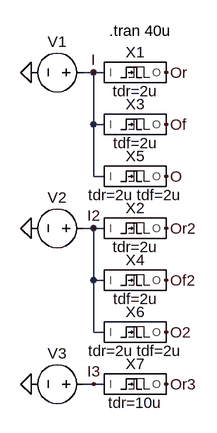
[diagram p0: schematic test-delay.asc]
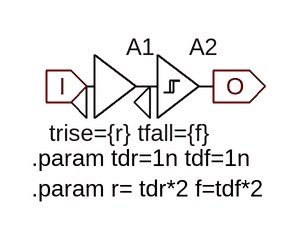
[diagram p1: sub-circuit delay.asc]
test-delay.asc, the LTspice schematic file:
Version 4
SHEET 1 880 680
WIRE 144 128 128 128
WIRE 160 128 144 128
WIRE 144 208 144 128
WIRE 160 208 144 208
WIRE 144 288 144 208
WIRE 160 288 144 288
WIRE 144 368 128 368
WIRE 160 368 144 368
WIRE 144 448 144 368
WIRE 160 448 144 448
WIRE 144 528 144 448
WIRE 160 528 144 528
WIRE 144 608 128 608
WIRE 160 608 144 608
FLAG 48 128 0
FLAG 144 128 I
FLAG 48 368 0
FLAG 144 368 I2
FLAG 256 128 Or
FLAG 256 368 Or2
FLAG 256 208 Of
FLAG 256 448 Of2
FLAG 256 288 O
FLAG 256 528 O2
FLAG 48 608 0
FLAG 144 608 I3
FLAG 256 608 Or3
SYMBOL delay 208 128 R0
WINDOW 39 0 44 Bottom 2
SYMATTR SpiceLine tdr=2u
SYMATTR InstName X1
SYMBOL voltage 144 128 M270
WINDOW 0 32 56 VTop 2
WINDOW 3 -32 56 Invisible 2
WINDOW 123 0 0 Left 0
WINDOW 39 0 0 Left 0
SYMATTR InstName V1
SYMATTR Value PULSE(0 1 10u 1n 1n 10u 20u)
SYMBOL voltage 144 368 M270
WINDOW 0 32 56 VTop 2
WINDOW 3 -32 56 Invisible 2
WINDOW 123 0 0 Left 0
WINDOW 39 0 0 Left 0
SYMATTR InstName V2
SYMATTR Value PULSE(0 1 10u 1n 1n 5u 20u)
SYMBOL delay 208 368 R0
WINDOW 39 0 44 Bottom 2
SYMATTR SpiceLine tdr=2u
SYMATTR InstName X2
SYMBOL delay 208 208 R0
WINDOW 39 0 44 Bottom 2
SYMATTR SpiceLine tdf=2u
SYMATTR InstName X3
SYMBOL delay 208 448 R0
WINDOW 39 0 44 Bottom 2
SYMATTR SpiceLine tdf=2u
SYMATTR InstName X4
SYMBOL delay 208 288 R0
WINDOW 39 0 44 Bottom 2
SYMATTR SpiceLine tdr=2u tdf=2u
SYMATTR InstName X5
SYMBOL delay 208 528 R0
WINDOW 39 0 44 Bottom 2
SYMATTR SpiceLine tdr=2u tdf=2u
SYMATTR InstName X6
SYMBOL voltage 144 608 M270
WINDOW 0 32 56 VTop 2
WINDOW 3 -32 56 Invisible 2
WINDOW 123 0 0 Left 0
WINDOW 39 0 0 Left 0
SYMATTR InstName V3
SYMATTR Value PULSE(0 1 10u 1n 1n 5u 20u)
SYMBOL delay 208 608 R0
WINDOW 39 0 44 Bottom 2
SYMATTR SpiceLine tdr=10u
SYMATTR InstName X7
TEXT 168 64 Left 2 !.tran 40u

delay.asc, the sub-circuit schematic file:
Version 4
SHEET 1 880 680
FLAG 144 176 0
FLAG 208 176 0
FLAG 272 160 O
IOPIN 272 160 Out
FLAG 144 160 I
IOPIN 144 160 In
SYMBOL Digital\\buf1 144 96 R0
WINDOW 3 -38 111 Left 2
SYMATTR Value trise={r} tfall={f}
SYMATTR InstName A1
SYMBOL Digital\\schmtbuf 208 96 R0
SYMATTR InstName A2
TEXT 88 232 Left 2 !.param tdr=1n tdf=1n\n.param r= tdr*2 f=tdf*2

The netlist it stands for:
* test-delay.asc
XX1 I Or delay params: tdr=2u
V1 I 0 PULSE(0 1 10u 1n 1n 10u 20u)
V2 I2 0 PULSE(0 1 10u 1n 1n 5u 20u)
XX2 I2 Or2 delay params: tdr=2u
XX3 I Of delay params: tdf=2u
XX4 I2 Of2 delay params: tdf=2u
XX5 I O delay params: tdr=2u tdf=2u
XX6 I2 O2 delay params: tdr=2u tdf=2u
V3 I3 0 PULSE(0 1 10u 1n 1n 5u 20u)
XX7 I3 Or3 delay params: tdr=10u

* block symbol definitions
.subckt delay I O
A1 I 0 0 0 0 0 P001 0 BUF trise={r} tfall={f}
A2 P001 0 0 0 0 0 O 0 SCHMITT
.param tdr=1n tdf=1n
.param r= tdr*2 f=tdf*2
.ends delay

.tran 40u
.backanno
.end